# EasyEDA Pro project ws2812_clock_PCB.epro, board PCB2
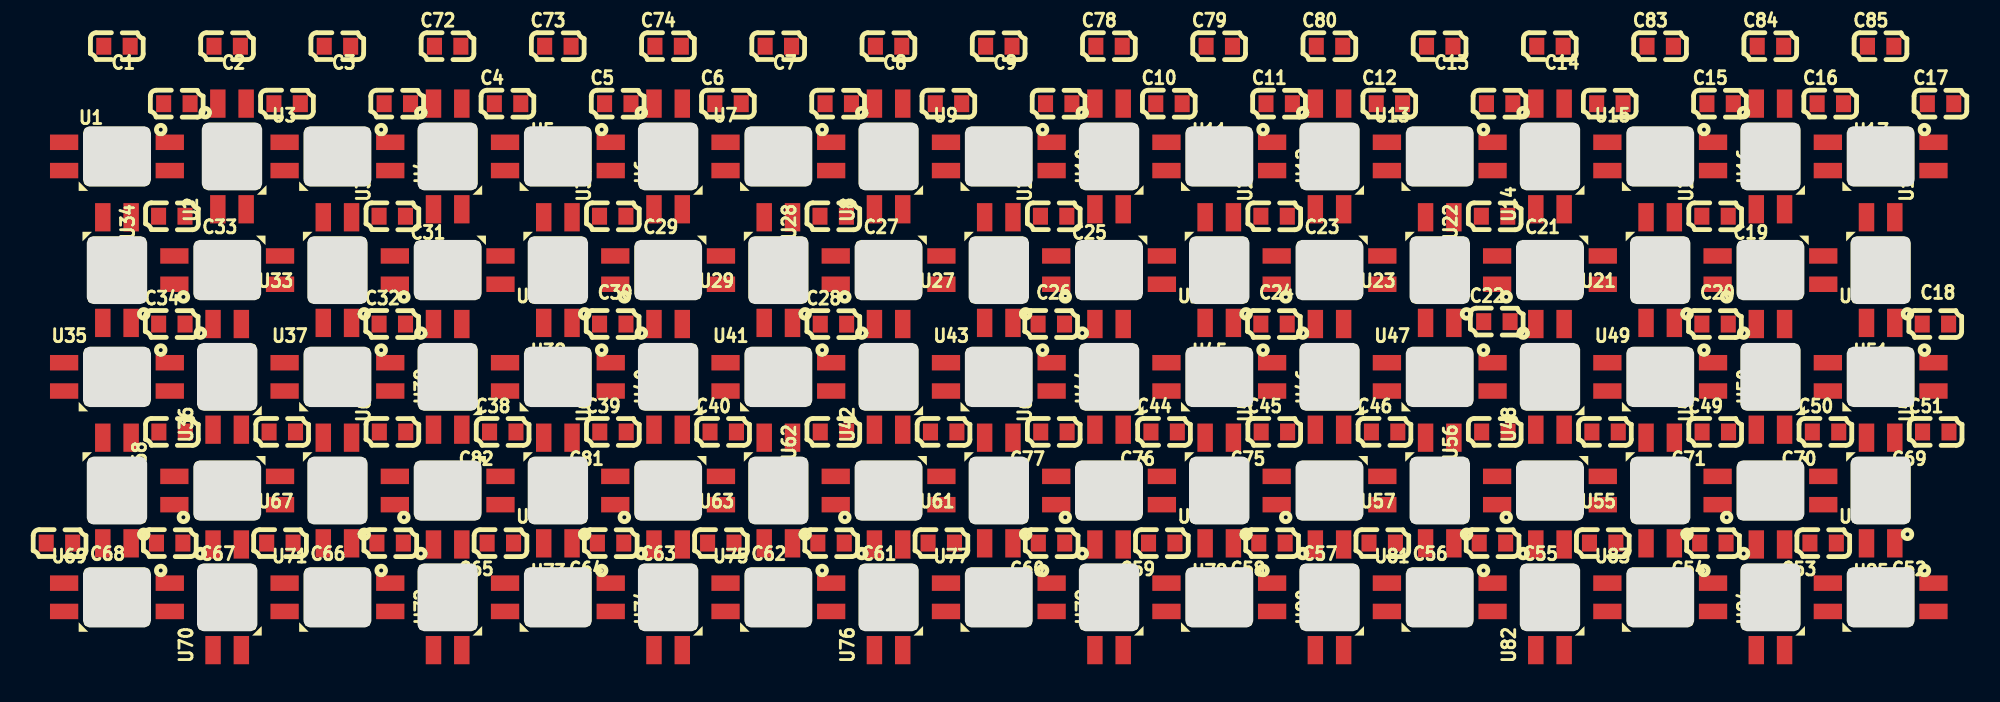
[diagram p2: board, top side]
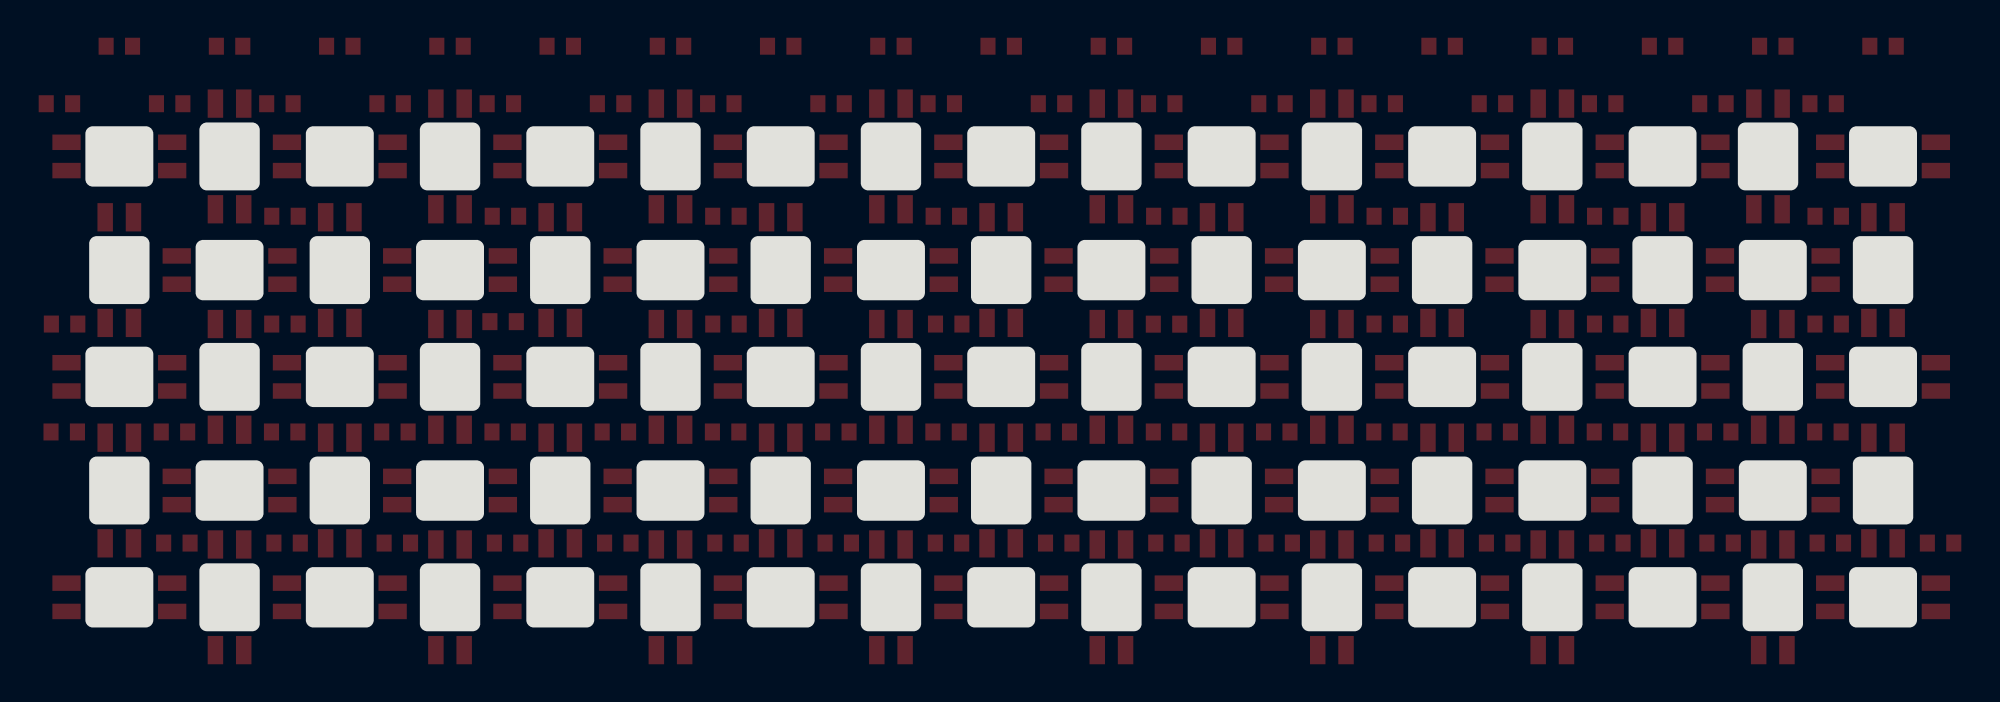
[diagram p3: board, bottom side, seen from below]

Outline 97.07 x 26.97 mm; copper layers: Top Layer, Bottom Layer. Coordinates in mm from the lower left corner of the outline.
Stack: Top Layer 0.035mm / Dielectric1 1.51mm FR4 er 4.5 / Bottom Layer 0.035mm

## Design rules (mm)
template: JLCPCB Capability(Two Layers Board)
spacing copperThickness1oz (default): track to track 0.102, other pairs 0.152 to 0.3
spacing copperThickness2oz: track to track 0.203, other pairs 0.152 to 0.3
track width copperThickness1oz (default): min 0.127, default 0.254, max 2.54
track width copperThickness2oz: min 0.203, default 0.254, max 2.54
differential pair differentialPair (default): width min 0.127, default 0.254, max 2.54; gap min 0.152, default 0.152
via viaSize (default): diameter min 0.5, default 0.61, max 10; hole min 0.3, default 0.305, max 6.3

## Placement (name value [footprint] x y rotation side)
C1  100nF  [C0603]  4.97 27.96 0 top
C2  100nF  [C0603]  10.82 27.96 0 top
C3  100nF  [C0603]  16.66 27.96 0 top
C4  100nF  [C0603]  22.5 27.96 0 top
C5  100nF  [C0603]  28.34 27.96 0 top
C6  100nF  [C0603]  34.18 27.96 0 top
C7  100nF  [C0603]  40.03 27.96 0 top
C8  100nF  [C0603]  45.87 27.96 0 top
C9  100nF  [C0603]  51.71 27.96 0 top
C10  100nF  [C0603]  57.55 27.96 0 top
C11  100nF  [C0603]  63.39 27.96 0 top
C12  100nF  [C0603]  69.24 27.96 0 top
C13  100nF  [C0603]  75.08 27.96 0 top
C14  100nF  [C0603]  80.92 27.96 0 top
C15  100nF  [C0603]  86.76 27.96 0 top
C16  100nF  [C0603]  92.61 27.96 0 top
C17  100nF  [C0603]  98.45 27.96 0 top
C18  100nF  [C0603]  98.17 16.28 0 top
C19  100nF  [C0603]  86.49 22 180 top
C20  100nF  [C0603]  86.5 16.28 0 top
C21  100nF  [C0603]  74.81 22 180 top
C22  100nF  [C0603]  74.93 16.41 0 top
C23  100nF  [C0603]  63.13 22 180 top
C24  100nF  [C0603]  63.12 16.28 0 top
C25  100nF  [C0603]  51.44 22 180 top
C26  100nF  [C0603]  51.32 16.28 0 top
C27  100nF  [C0603]  39.76 22 180 top
C28  100nF  [C0603]  39.77 16.28 0 top
C29  100nF  [C0603]  28.07 22 180 top
C30  100nF  [C0603]  28.08 16.28 0 top
C31  100nF  [C0603]  16.39 22 180 top
C32  100nF  [C0603]  16.39 16.28 0 top
C33  100nF  [C0603]  4.71 22 180 top
C34  100nF  [C0603]  4.71 16.28 0 top
C35  100nF  [C0603]  4.72 10.56 0 top
C36  100nF  [C0603]  10.56 10.56 0 top
C37  100nF  [C0603]  16.41 10.56 0 top
C38  100nF  [C0603]  22.25 10.56 0 top
C39  100nF  [C0603]  28.09 10.56 0 top
C40  100nF  [C0603]  33.93 10.56 0 top
C41  100nF  [C0603]  39.77 10.56 0 top
C42  100nF  [C0603]  45.61 10.56 0 top
C43  100nF  [C0603]  51.46 10.56 0 top
C44  100nF  [C0603]  57.3 10.56 0 top
C45  100nF  [C0603]  63.14 10.56 0 top
C46  100nF  [C0603]  68.98 10.56 0 top
C47  100nF  [C0603]  74.83 10.56 0 top
C48  100nF  [C0603]  80.67 10.56 0 top
C49  100nF  [C0603]  86.51 10.56 0 top
C50  100nF  [C0603]  92.35 10.56 0 top
C51  100nF  [C0603]  98.19 10.56 0 top
C52  100nF  [C0603]  92.22 4.67 180 top
C53  100nF  [C0603]  86.38 4.67 180 top
C54  100nF  [C0603]  80.54 4.67 180 top
C55  100nF  [C0603]  74.7 4.67 180 top
C56  100nF  [C0603]  68.86 4.67 180 top
C57  100nF  [C0603]  63.01 4.67 180 top
C58  100nF  [C0603]  57.17 4.67 180 top
C59  100nF  [C0603]  51.33 4.67 180 top
C60  100nF  [C0603]  45.49 4.67 180 top
C61  100nF  [C0603]  39.64 4.67 180 top
C62  100nF  [C0603]  33.8 4.67 180 top
C63  100nF  [C0603]  27.96 4.67 180 top
C64  100nF  [C0603]  22.12 4.67 180 top
C65  100nF  [C0603]  16.28 4.67 180 top
C66  100nF  [C0603]  10.44 4.67 180 top
C67  100nF  [C0603]  4.59 4.67 180 top
C68  100nF  [C0603]  -1.25 4.67 180 top
C69  100nF  [C0603]  1.8 31.01 0 top
C70  100nF  [C0603]  7.64 31.01 0 top
C71  100nF  [C0603]  13.48 31.01 0 top
C72  100nF  [C0603]  19.33 31.01 0 top
C73  100nF  [C0603]  25.17 31.01 0 top
C74  100nF  [C0603]  31.01 31.01 0 top
C75  100nF  [C0603]  36.85 31.01 0 top
C76  100nF  [C0603]  42.69 31.01 0 top
C77  100nF  [C0603]  48.54 31.01 0 top
C78  100nF  [C0603]  54.38 31.01 0 top
C79  100nF  [C0603]  60.22 31.01 0 top
C80  100nF  [C0603]  66.06 31.01 0 top
C81  100nF  [C0603]  71.9 31.01 0 top
C82  100nF  [C0603]  77.75 31.01 0 top
C83  100nF  [C0603]  83.59 31.01 0 top
C84  100nF  [C0603]  89.43 31.01 0 top
C85  100nF  [C0603]  95.27 31.01 0 top
U1  SK6812MINI-E  [LED-SMD_L3.2-W2.8-TR]  1.8 25.17 0 top
U2  SK6812MINI-E  [LED-SMD_L3.2-W2.8-TR]  7.9 25.17 90 top
U3  SK6812MINI-E  [LED-SMD_L3.2-W2.8-TR]  13.48 25.17 0 top
U4  SK6812MINI-E  [LED-SMD_L3.2-W2.8-TR]  19.33 25.17 90 top
U5  SK6812MINI-E  [LED-SMD_L3.2-W2.8-TR]  25.17 25.17 0 top
U6  SK6812MINI-E  [LED-SMD_L3.2-W2.8-TR]  31.01 25.17 90 top
U7  SK6812MINI-E  [LED-SMD_L3.2-W2.8-TR]  36.85 25.17 0 top
U8  SK6812MINI-E  [LED-SMD_L3.2-W2.8-TR]  42.69 25.17 90 top
U9  SK6812MINI-E  [LED-SMD_L3.2-W2.8-TR]  48.54 25.17 0 top
U10  SK6812MINI-E  [LED-SMD_L3.2-W2.8-TR]  54.38 25.17 90 top
U11  SK6812MINI-E  [LED-SMD_L3.2-W2.8-TR]  60.22 25.17 0 top
U12  SK6812MINI-E  [LED-SMD_L3.2-W2.8-TR]  66.06 25.17 90 top
U13  SK6812MINI-E  [LED-SMD_L3.2-W2.8-TR]  71.9 25.17 0 top
U14  SK6812MINI-E  [LED-SMD_L3.2-W2.8-TR]  77.75 25.17 90 top
U15  SK6812MINI-E  [LED-SMD_L3.2-W2.8-TR]  83.59 25.17 0 top
U16  SK6812MINI-E  [LED-SMD_L3.2-W2.8-TR]  89.43 25.17 90 top
U17  SK6812MINI-E  [LED-SMD_L3.2-W2.8-TR]  95.27 25.17 0 top
U18  SK6812MINI-E  [LED-SMD_L3.2-W2.8-TR]  95.27 19.14 270 top
U19  SK6812MINI-E  [LED-SMD_L3.2-W2.8-TR]  89.43 19.14 180 top
U20  SK6812MINI-E  [LED-SMD_L3.2-W2.8-TR]  83.59 19.14 270 top
U21  SK6812MINI-E  [LED-SMD_L3.2-W2.8-TR]  77.75 19.14 180 top
U22  SK6812MINI-E  [LED-SMD_L3.2-W2.8-TR]  71.9 19.14 270 top
U23  SK6812MINI-E  [LED-SMD_L3.2-W2.8-TR]  66.06 19.14 180 top
U24  SK6812MINI-E  [LED-SMD_L3.2-W2.8-TR]  60.22 19.14 270 top
U25  SK6812MINI-E  [LED-SMD_L3.2-W2.8-TR]  54.38 19.14 180 top
U26  SK6812MINI-E  [LED-SMD_L3.2-W2.8-TR]  48.54 19.14 270 top
U27  SK6812MINI-E  [LED-SMD_L3.2-W2.8-TR]  42.69 19.14 180 top
U28  SK6812MINI-E  [LED-SMD_L3.2-W2.8-TR]  36.85 19.14 270 top
U29  SK6812MINI-E  [LED-SMD_L3.2-W2.8-TR]  31.01 19.14 180 top
U30  SK6812MINI-E  [LED-SMD_L3.2-W2.8-TR]  25.17 19.14 270 top
U31  SK6812MINI-E  [LED-SMD_L3.2-W2.8-TR]  19.33 19.14 180 top
U32  SK6812MINI-E  [LED-SMD_L3.2-W2.8-TR]  13.48 19.14 270 top
U33  SK6812MINI-E  [LED-SMD_L3.2-W2.8-TR]  7.64 19.14 180 top
U34  SK6812MINI-E  [LED-SMD_L3.2-W2.8-TR]  1.8 19.14 270 top
U35  SK6812MINI-E  [LED-SMD_L3.2-W2.8-TR]  1.8 13.48 0 top
U36  SK6812MINI-E  [LED-SMD_L3.2-W2.8-TR]  7.64 13.48 90 top
U37  SK6812MINI-E  [LED-SMD_L3.2-W2.8-TR]  13.48 13.48 0 top
U38  SK6812MINI-E  [LED-SMD_L3.2-W2.8-TR]  19.33 13.48 90 top
U39  SK6812MINI-E  [LED-SMD_L3.2-W2.8-TR]  25.17 13.48 0 top
U40  SK6812MINI-E  [LED-SMD_L3.2-W2.8-TR]  31.01 13.48 90 top
U41  SK6812MINI-E  [LED-SMD_L3.2-W2.8-TR]  36.85 13.48 0 top
U42  SK6812MINI-E  [LED-SMD_L3.2-W2.8-TR]  42.69 13.48 90 top
U43  SK6812MINI-E  [LED-SMD_L3.2-W2.8-TR]  48.54 13.48 0 top
U44  SK6812MINI-E  [LED-SMD_L3.2-W2.8-TR]  54.38 13.48 90 top
U45  SK6812MINI-E  [LED-SMD_L3.2-W2.8-TR]  60.22 13.48 0 top
U46  SK6812MINI-E  [LED-SMD_L3.2-W2.8-TR]  66.06 13.48 90 top
U47  SK6812MINI-E  [LED-SMD_L3.2-W2.8-TR]  71.9 13.48 0 top
U48  SK6812MINI-E  [LED-SMD_L3.2-W2.8-TR]  77.75 13.48 90 top
U49  SK6812MINI-E  [LED-SMD_L3.2-W2.8-TR]  83.59 13.48 0 top
U50  SK6812MINI-E  [LED-SMD_L3.2-W2.8-TR]  89.43 13.48 90 top
U51  SK6812MINI-E  [LED-SMD_L3.2-W2.8-TR]  95.27 13.48 0 top
U52  SK6812MINI-E  [LED-SMD_L3.2-W2.8-TR]  95.27 7.46 270 top
U53  SK6812MINI-E  [LED-SMD_L3.2-W2.8-TR]  89.43 7.46 180 top
U54  SK6812MINI-E  [LED-SMD_L3.2-W2.8-TR]  83.59 7.46 270 top
U55  SK6812MINI-E  [LED-SMD_L3.2-W2.8-TR]  77.75 7.46 180 top
U56  SK6812MINI-E  [LED-SMD_L3.2-W2.8-TR]  71.9 7.46 270 top
U57  SK6812MINI-E  [LED-SMD_L3.2-W2.8-TR]  66.06 7.46 180 top
U58  SK6812MINI-E  [LED-SMD_L3.2-W2.8-TR]  60.22 7.46 270 top
U59  SK6812MINI-E  [LED-SMD_L3.2-W2.8-TR]  54.38 7.46 180 top
U60  SK6812MINI-E  [LED-SMD_L3.2-W2.8-TR]  48.54 7.46 270 top
U61  SK6812MINI-E  [LED-SMD_L3.2-W2.8-TR]  42.69 7.46 180 top
U62  SK6812MINI-E  [LED-SMD_L3.2-W2.8-TR]  36.85 7.46 270 top
U63  SK6812MINI-E  [LED-SMD_L3.2-W2.8-TR]  31.01 7.46 180 top
U64  SK6812MINI-E  [LED-SMD_L3.2-W2.8-TR]  25.17 7.46 270 top
U65  SK6812MINI-E  [LED-SMD_L3.2-W2.8-TR]  19.33 7.46 180 top
U66  SK6812MINI-E  [LED-SMD_L3.2-W2.8-TR]  13.48 7.46 270 top
U67  SK6812MINI-E  [LED-SMD_L3.2-W2.8-TR]  7.64 7.46 180 top
U68  SK6812MINI-E  [LED-SMD_L3.2-W2.8-TR]  1.8 7.46 270 top
U69  SK6812MINI-E  [LED-SMD_L3.2-W2.8-TR]  1.8 1.8 0 top
U70  SK6812MINI-E  [LED-SMD_L3.2-W2.8-TR]  7.64 1.8 90 top
U71  SK6812MINI-E  [LED-SMD_L3.2-W2.8-TR]  13.48 1.8 0 top
U72  SK6812MINI-E  [LED-SMD_L3.2-W2.8-TR]  19.33 1.8 90 top
U73  SK6812MINI-E  [LED-SMD_L3.2-W2.8-TR]  25.17 1.8 0 top
U74  SK6812MINI-E  [LED-SMD_L3.2-W2.8-TR]  31.01 1.8 90 top
U75  SK6812MINI-E  [LED-SMD_L3.2-W2.8-TR]  36.85 1.8 0 top
U76  SK6812MINI-E  [LED-SMD_L3.2-W2.8-TR]  42.69 1.8 90 top
U77  SK6812MINI-E  [LED-SMD_L3.2-W2.8-TR]  48.54 1.8 0 top
U78  SK6812MINI-E  [LED-SMD_L3.2-W2.8-TR]  54.38 1.8 90 top
U79  SK6812MINI-E  [LED-SMD_L3.2-W2.8-TR]  60.22 1.8 0 top
U80  SK6812MINI-E  [LED-SMD_L3.2-W2.8-TR]  66.06 1.8 90 top
U81  SK6812MINI-E  [LED-SMD_L3.2-W2.8-TR]  71.9 1.8 0 top
U82  SK6812MINI-E  [LED-SMD_L3.2-W2.8-TR]  77.75 1.8 90 top
U83  SK6812MINI-E  [LED-SMD_L3.2-W2.8-TR]  83.59 1.8 0 top
U84  SK6812MINI-E  [LED-SMD_L3.2-W2.8-TR]  89.43 1.8 90 top
U85  SK6812MINI-E  [LED-SMD_L3.2-W2.8-TR]  95.27 1.8 0 top

## Footprints (pads in the part's own frame, mm; a bottom-side part is the same pattern mirrored in y, then rotated)
C0603
  rect 0.8x0.9 smd: 1(-0.7,0) 2(0.7,0)
LED-SMD_L3.2-W2.8-TR
  rect 1.5x0.82 smd: 1(2.8,0.75) 2(2.8,-0.75) 3(-2.8,-0.75) 4(-2.8,0.75)

## Nets
As in the schematic.

Pads without a net: U1 2; U15 4; U16 2; U32 4; U33 2; U49 4; U50 2; U66 4; U67 2; U83 4; U84 2; U85 4
